# Altium schematic sheet PT1000焊盘.schdoc
size 127 x 101 mm
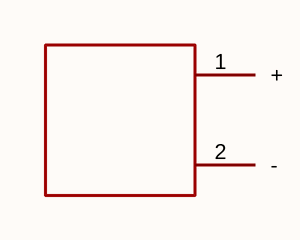
[diagram p0: PT1000焊盘.schdoc]

## Parts
U?  pt1000焊盘  (value not drawn)

## Nets

Not connected (* = marked no-connect by the designer): U? 1(+) 2(-)

## Library data of the parts
U? = pt1000焊盘: AddInBom: yes; SymbolName: PT1000焊盘; ConvertToPcb: yes